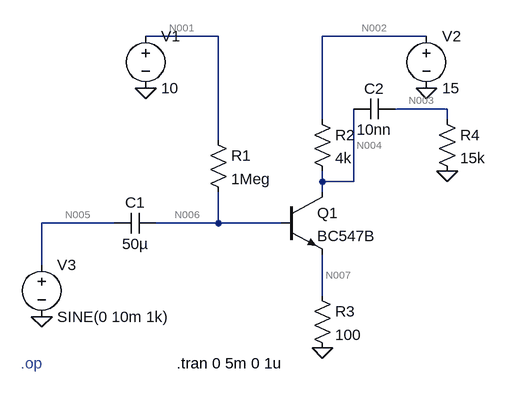
[diagram p0: schematic Draft1.asc]
Draft1.asc, the LTspice schematic file:
Version 4
SHEET 1 880 680
WIRE 64 -128 -48 -128
WIRE 384 -128 224 -128
WIRE 416 -16 336 -16
WIRE 224 0 224 -128
WIRE 416 0 416 -16
WIRE 64 32 64 -128
WIRE 224 96 224 80
WIRE 272 96 272 -16
WIRE 272 96 224 96
WIRE 224 112 224 96
WIRE -96 160 -208 160
WIRE 64 160 64 112
WIRE 64 160 -32 160
WIRE 160 160 64 160
WIRE -208 224 -208 160
WIRE 224 272 224 208
FLAG 224 352 0
FLAG 384 -48 0
FLAG -48 -48 0
FLAG -208 304 0
FLAG 416 80 0
SYMBOL npn 160 112 R0
SYMATTR InstName Q1
SYMATTR Value BC547B
SYMBOL res 48 16 R0
SYMATTR InstName R1
SYMATTR Value 1Meg
SYMBOL res 208 -16 R0
SYMATTR InstName R2
SYMATTR Value 4k
SYMBOL res 208 256 R0
SYMATTR InstName R3
SYMATTR Value 100
SYMBOL voltage 384 -144 R0
WINDOW 123 0 0 Left 0
WINDOW 39 0 0 Left 0
SYMATTR InstName V2
SYMATTR Value 15
SYMBOL voltage -48 -144 R0
WINDOW 123 0 0 Left 0
WINDOW 39 0 0 Left 0
SYMATTR InstName V1
SYMATTR Value 10
SYMBOL voltage -208 208 R0
WINDOW 123 0 0 Left 0
WINDOW 39 0 0 Left 0
SYMATTR InstName V3
SYMATTR Value SINE(0 10m 1k)
SYMBOL cap -32 144 R90
WINDOW 0 0 32 VBottom 2
WINDOW 3 32 32 VTop 2
SYMATTR InstName C1
SYMATTR Value 50µ
SYMBOL res 400 -16 R0
SYMATTR InstName R4
SYMATTR Value 15k
SYMBOL cap 336 -32 R90
WINDOW 0 0 32 VBottom 2
WINDOW 3 32 32 VTop 2
SYMATTR InstName C2
SYMATTR Value 10nn
TEXT -240 376 Left 2 ;.op
TEXT 0 376 Left 2 !.tran 0 5m 0 1u

The netlist it stands for:
* Draft1.asc
Q1 N004 N006 N007 0 BC547B
R1 N001 N006 1Meg
R2 N002 N004 4k
R3 N007 0 100
V2 N002 0 15
V1 N001 0 10
V3 N005 0 SINE(0 10m 1k)
C1 N006 N005 50µ
R4 N003 0 15k
C2 N003 N004 10nn
.model NPN NPN
.model PNP PNP
.lib standard.bjt
* .op
.tran 0 5m 0 1u
.backanno
.end

* Results of the author's LTspice run, read from the files saved beside the schematic
* Operating Point, zero values left out:
*   V(n004) = 4.307 V
*   V(n006) = 932.6 mV
*   V(n007) = 268.2 mV
*   V(n001) = 10 V
*   V(n002) = 15 V
*   Ic(Q1) = 2.673 mA
*   Ib(Q1) = 9.067 µA
*   Ie(Q1) = -2.682 mA
*   I(R1) = 9.067 µA
*   I(R2) = 2.673 mA
*   I(R3) = 2.682 mA
*   I(V2) = -2.673 mA
*   I(V1) = -9.067 µA
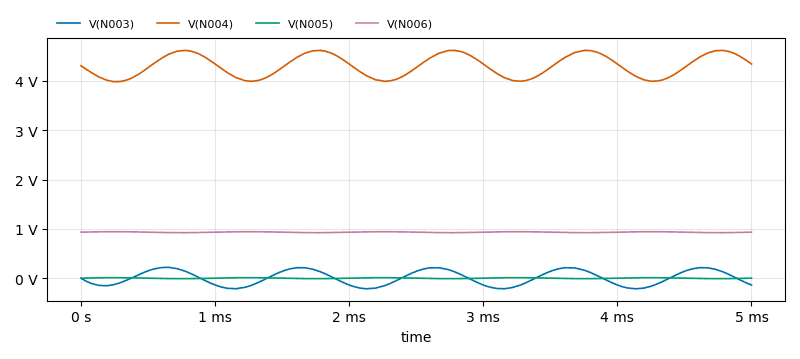
[diagram p1: Transient Analysis of Draft1.asc, plotted from the saved traces]
* Transient Analysis, 1 run:
*   V(N003): min -215.6 mV, max 218.5 mV, average 5.228 mV, rms 148 mV, last -138.5 mV
*   V(N004): min 3.986 V, max 4.62 V, average 4.305 V, rms 4.311 V, last 4.343 V
*   V(N005): min -9.992 mV, max 9.999 mV, average 1.571 µV, rms 7.05 mV, last 0 V
*   V(N006): min 922.6 mV, max 942.6 mV, average 932.6 mV, rms 932.6 mV, last 932.6 mV